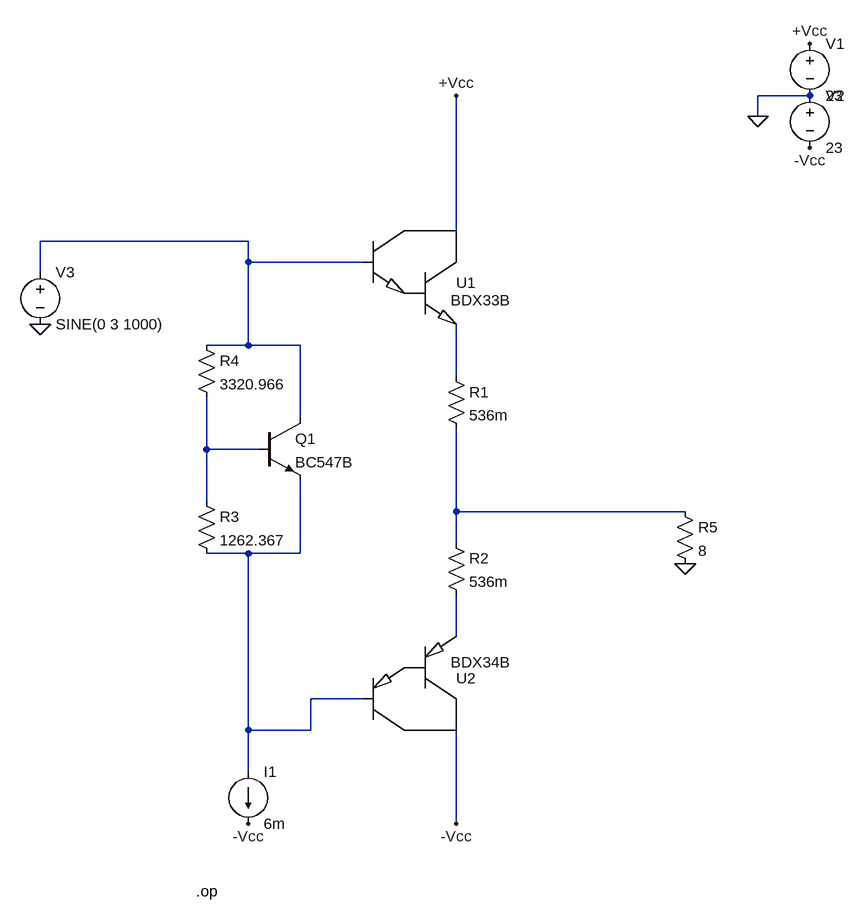
[diagram p0: schematic vbemulti.asc]
vbemulti.asc, the LTspice schematic file:
Version 4
SHEET 1 1984 1128
WIRE 976 -112 896 -112
WIRE 896 -80 896 -112
WIRE 432 96 432 -112
WIRE 112 112 -208 112
WIRE 112 144 112 112
WIRE 288 144 112 144
WIRE -208 160 -208 112
WIRE 112 272 112 144
WIRE 112 272 48 272
WIRE 192 272 112 272
WIRE 432 320 432 240
WIRE 192 384 192 272
WIRE 48 432 48 352
WIRE 128 432 48 432
WIRE 48 512 48 432
WIRE 432 528 432 400
WIRE 784 528 432 528
WIRE 432 576 432 528
WIRE 112 592 48 592
WIRE 192 592 192 480
WIRE 192 592 112 592
WIRE 432 720 432 656
WIRE 288 816 208 816
WIRE 112 864 112 592
WIRE 208 864 208 816
WIRE 208 864 112 864
WIRE 112 928 112 864
WIRE 432 1008 432 864
FLAG 784 608 0
FLAG 976 -192 +Vcc
FLAG 432 -112 +Vcc
FLAG 976 -32 -Vcc
FLAG 432 1008 -Vcc
FLAG 896 -80 0
FLAG -208 240 0
FLAG 112 1008 -Vcc
SYMBOL res 32 496 R0
SYMATTR InstName R3
SYMATTR Value 1262.367
SYMBOL res 32 256 R0
SYMATTR InstName R4
SYMATTR Value 3320.966
SYMBOL npn 128 384 R0
SYMATTR InstName Q1
SYMATTR Value BC547B
SYMBOL current 112 928 R0
WINDOW 123 0 0 Left 0
WINDOW 39 0 0 Left 0
SYMATTR InstName I1
SYMATTR Value 6m
SYMBOL voltage 976 -208 R0
WINDOW 123 0 0 Left 0
WINDOW 39 0 0 Left 0
SYMATTR InstName V1
SYMATTR Value 23
SYMBOL voltage 976 -128 R0
WINDOW 123 0 0 Left 0
WINDOW 39 0 0 Left 0
SYMATTR InstName V2
SYMATTR Value 23
SYMBOL res 768 512 R0
SYMATTR InstName R5
SYMATTR Value 8
SYMBOL myLib\\BDX33B 304 96 R0
SYMATTR InstName U1
SYMBOL myLib\\BDX34B 288 864 M180
SYMATTR InstName U2
SYMBOL voltage -208 144 R0
WINDOW 123 0 0 Left 0
WINDOW 39 0 0 Left 0
SYMATTR InstName V3
SYMATTR Value SINE(0 3 1000)
SYMBOL res 416 304 R0
SYMATTR InstName R1
SYMATTR Value 536m
SYMBOL res 416 560 R0
SYMATTR InstName R2
SYMATTR Value 536m
TEXT 32 1112 Left 0 !.op

The netlist it stands for:
* vbemulti.asc
R3 N003 N005 1262.367
R4 N001 N003 3320.966
Q1 N001 N003 N005 0 BC547B
I1 N005 -Vcc 6m
V1 +Vcc 0 23
V2 0 -Vcc 23
R5 N004 0 8
XU1 +Vcc N001 N002 BDX33B  ; pins C B E
XU2 -Vcc N005 N006 BDX34B  ; pins C B E
V3 N001 0 SINE(0 3 1000)
R1 N002 N004 536m
R2 N004 N006 536m
.model NPN NPN
.model PNP PNP
.lib standard.bjt
.op
.lib myLib\BDX33B.lib
.lib myLib\BDX34B.lib
.backanno
.end